# EAGLE schematic esquema_eletrico (EAGLE 7.2.0)
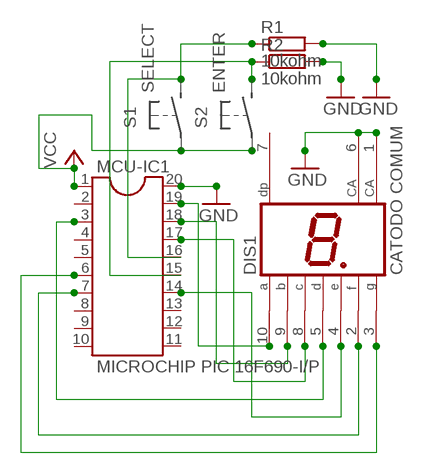
[diagram p0: schematic, sheet 1]

## Parts
DIS1  CATODO COMUM  HD-A101  [HDSP-A]
MCU-IC1  MICROCHIP PIC 16F690-I/P  DIL20  [DIL20]
R1  10kohm  R-EU_0204/2V  [0204V]
R2  10kohm  R-EU_0204/2V  [0204V]

## Nets
GND: DIS1.1(CA) DIS1.6(CA) MCU-IC1.20 R1.2 R2.2
N$1: DIS1.10(A) MCU-IC1.19
N$2: DIS1.9(B) MCU-IC1.18
N$3: DIS1.8(C) MCU-IC1.17
N$4: DIS1.5(D) MCU-IC1.3
N$5: DIS1.4(E) MCU-IC1.14
N$6: DIS1.2(F) MCU-IC1.7
N$7: DIS1.3(G) MCU-IC1.6
N$8: MCU-IC1.15 R2.1
N$9: MCU-IC1.16 R1.1
VDD: MCU-IC1.1 ; supply symbol labelled VCC
Unconnected: DIS1.7(DP) MCU-IC1.2 MCU-IC1.4 MCU-IC1.5 MCU-IC1.8 MCU-IC1.9 MCU-IC1.10 MCU-IC1.11 MCU-IC1.12 MCU-IC1.13

## Library data of the parts
DIS1 = display-hp:HD-A101: LED DISPLAY 1-character 7 segment, decimal point right; OC_FARNELL: unknown; OC_NEWARK: unknown
MCU-IC1 = ic-package:DIL20: Dual In Line / Socket
R1 R2 = resistor:R-EU_: RESISTOR, European symbol